# Altium schematic sheet Motor-20.SchDoc
size B; SheetNumber: 1; SheetTotal: 1
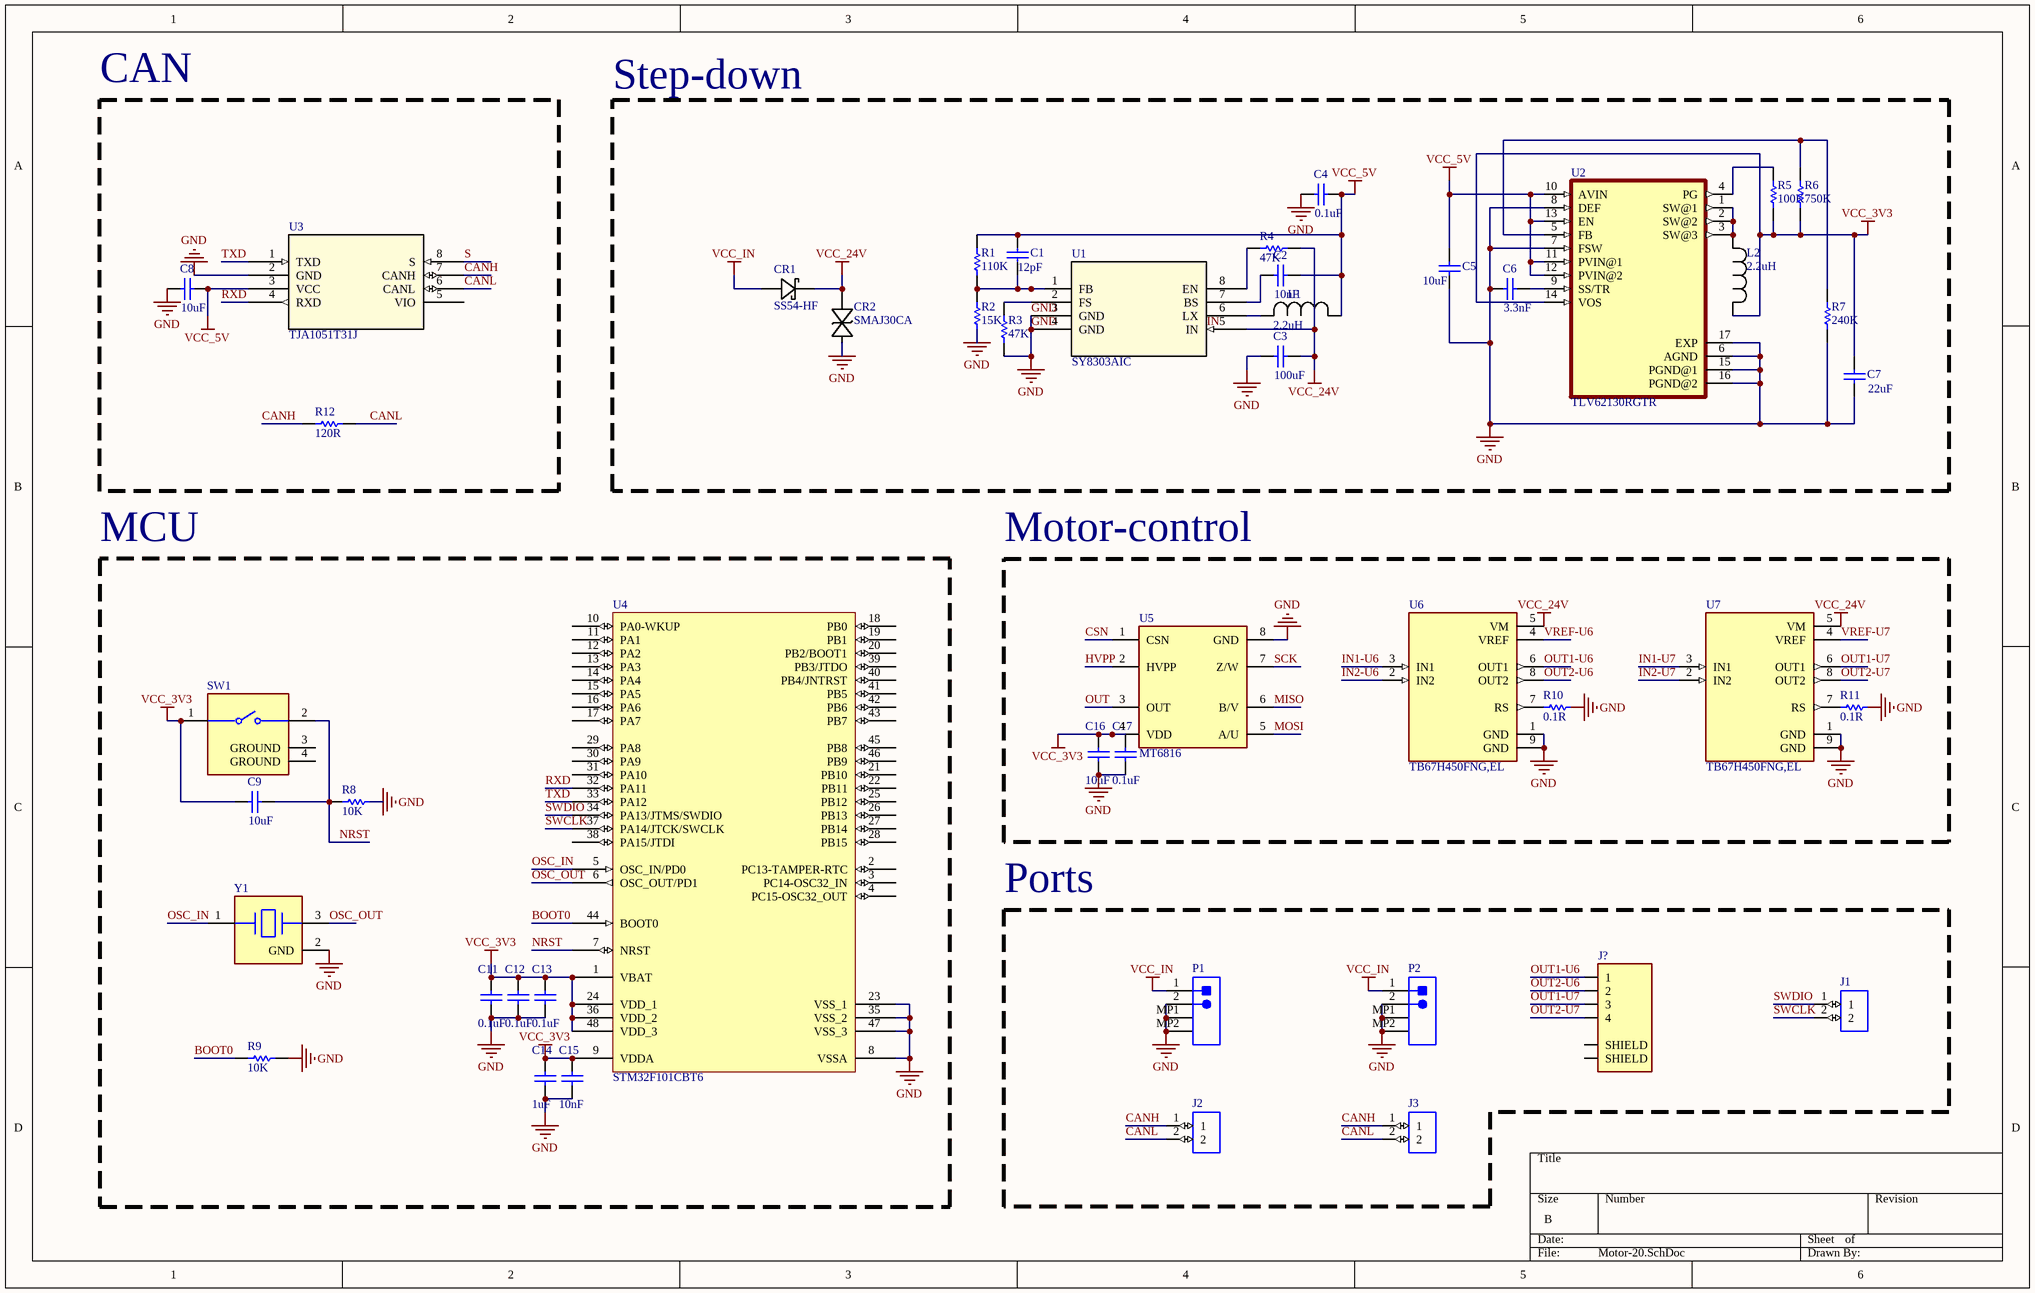
[diagram p0: Motor-20.SchDoc]

## Parts
C1  12pF  [CAPC1608X90X35ML10T15]
C2  10nF  [CAPC1608X90X35ML10T15]
C3  100uF  [CAPC1608X90X35ML10T15]
C4  0.1uF  [CAPC1608X90X35ML10T15]
C5  10uF  [CAPC1608X90X35ML10T15]
C6  3.3nF  [CAPC1608X90X35ML10T15]
C7  22uF  [CAPC1608X90X35ML10T15]
C8  10uF  [CAPC1608X90X35ML10T15]
C9  10uF  [CAPC1608X90X35ML10T15]
C11  0.1uF  [CAPC1608X90X35ML10T15]
C12  0.1uF  [CAPC1608X90X35ML10T15]
C13  0.1uF  [CAPC1608X90X35ML10T15]
C14  1uF  [CAPC1608X90X35ML10T15]
C15  10nF  [CAPC1608X90X35ML10T15]
C16  10uF  [CAPC1608X90X35ML10T15]
C17  0.1uF  [CAPC1608X90X35ML10T15]
CR1  SS54-HF  [SDO_DO-214AC_CIP]
CR2  SMAJ30CA  [SMASeries_LTF]
J1  (no value)  [SM02B-SRSS-TB(LF)(SN)]
J2  (no value)  [SM02B-SRSS-TB(LF)(SN)]
J3  (no value)  [SM02B-SRSS-TB(LF)(SN)]
J?  (no value)  [JST_SM04B-SRSS-TB(LF)(SN)]
L1  2.2uH  [IND_EPCOS_B82498F_EPC]
L2  2.2uH  [IND_EPCOS_B82498F_EPC]
P1  (no value)  [JST- S2B-PH-SM4-TB(LF)(SN)-2_V]
P2  (no value)  [JST- S2B-PH-SM4-TB(LF)(SN)-2_V]
R1  110K  [RESC1608X55X30ML20T20]
R2  15K  [RESC1608X55X30ML20T20]
R3  47K  [RESC1608X55X30ML20T20]
R4  47K  [RESC1608X55X30ML20T20]
R5  100K  [RESC1608X55X30ML20T20]
R6  750K  [RESC1608X55X30ML20T20]
R7  240K  [RESC1608X55X30ML20T20]
R8  10K  [RESC1608X55X30ML20T20]
R9  10K  [RESC1608X55X30ML20T20]
R10  0.1R  [RESC1608X55X30ML20T20]
R11  0.1R  [RESC1608X55X30ML20T20]
R12  120R  [RESC1608X55X30ML20T20]
SW1  (no value)  [FP-PTS636_SKG25_SMTR_LFS-MFG]
U1  SY8303AIC  [TSOT_303AIC_SGY]
U2  TLV62130RGTR  [QFN50P300X300X100-17N]
U3  TJA1051T31J  [SO8_SOT96-1_NXP]
U4  STM32F101CBT6  [LQFP48_N]
U5  MT6816  [SOIC127P600X175-8N-8-V]
U6  TB67H450FNG,EL  [SOIC127P599X175-9N]
U7  TB67H450FNG,EL  [SOIC127P599X175-9N]
Y1  (no value)  [FP-CSTCE_V-MFG]

## Blocks framed on the sheet
CAN: C8 R12 U3
Step-down: C1-C7 CR1 CR2 L1 L2 R1-R7 U1 U2
MCU: C9 C11-C15 R8 R9 SW1 U4 Y1
Motor-control: C16 C17 R10 R11 U5-U7
Ports: J1-J3 J? P1 P2

## Nets
GND: C3.1 C4.1 C5.1 C6.1 C7.1 C8.1 C11.1 C12.1 C13.1 C14.1 C15.1 C16.1 C17.1 CR2.2 P1.2 P1.MP1 P1.MP2 P2.2 P2.MP1 P2.MP2 R2.1 R3.1 R7.1 R8.2 R9.2 U1.3(GND) U1.4(GND) U2.6(AGND) U2.7(FSW) U2.8(DEF) U2.15(PGND@1) U2.16(PGND@2) U2.17(EXP) U3.2(GND) U4.8(VSSA) U4.23(VSS_1) U4.35(VSS_2) U4.47(VSS_3) U5.8(GND) U6.1(GND) U6.9(GND) U7.1(GND) U7.9(GND) Y1.2(GND)
VCC_3V3: C7.2 C9.1 C11.2 C12.2 C13.2 C14.2 C15.2 C16.2 C17.2 L2.1 R5.1 R6.1 SW1.1 U2.14(VOS) U4.1(VBAT) U4.9(VDDA) U4.24(VDD_1) U4.36(VDD_2) U4.48(VDD_3) U5.4(VDD)
VCC_5V: C1.2 C2.2 C4.2 C5.2 C8.2 L1.1 R1.2 U2.10(AVIN) U2.11(PVIN@1) U2.12(PVIN@2) U2.13(EN) U3.3(VCC)
VCC_24V: C3.2 CR1.1(CATHODE) CR2.1 R4.2 U1.5(IN) U6.5(VM) U7.5(VM)
VCC_IN: CR1.2(ANODE) P1.1 P2.1
BOOT0: R9.1 U4.44(BOOT0)
CANH: J2.1 J3.1 R12.1 U3.7(CANH)
CANL: J2.2 J3.2 R12.2 U3.6(CANL)
CSN: U5.1(CSN)
HVPP: U5.2(HVPP)
IN1-U6: U6.3(IN1)
IN1-U7: U7.3(IN1)
IN2-U6: U6.2(IN2)
IN2-U7: U7.2(IN2)
MISO: U5.6(B/V)
MOSI: U5.5(A/U)
NRST: C9.2 R8.1 SW1.2 U4.7(NRST)
OSC_IN: U4.5(OSC_IN/PD0) Y1.1(Input)
OSC_OUT: U4.6(OSC_OUT/PD1) Y1.3(Output)
OUT: U5.3(OUT)
OUT1-U6: J?.1 U6.6(OUT1)
OUT1-U7: J?.3 U7.6(OUT1)
OUT2-U6: J?.2 U6.8(OUT2)
OUT2-U7: J?.4 U7.8(OUT2)
RXD: U3.4(RXD) U4.32(PA11)
S: U3.8(S)
SCK: U5.7(Z/W)
SWCLK: J1.2 U4.37(PA14/JTCK/SWCLK)
SWDIO: J1.1 U4.34(PA13/JTMS/SWDIO)
TXD: U3.1(TXD) U4.33(PA12)
VREF-U6: U6.4(VREF)
VREF-U7: U7.4(VREF)
NetC1_1: C1.1 R1.1 R2.2 U1.1(FB)
NetC2_1: C2.1 U1.7(BS)
NetC6_2: C6.2 U2.9(SS/TR)
NetL1_2: L1.2 U1.6(LX)
NetL2_2: L2.2 U2.1(SW@1) U2.2(SW@2) U2.3(SW@3)
NetR3_2: R3.2 U1.2(FS)
NetR4_1: R4.1 U1.8(EN)
NetR5_2: R5.2 U2.4(PG)
NetR6_2: R6.2 R7.2 U2.5(FB)

Not connected (* = marked no-connect by the designer): J? S1(SHIELD) S2(SHIELD); R10 1 2; R11 1 2; SW1 3(GROUND) 4(GROUND); U3 5(VIO); U4 2(PC13-TAMPER-RTC) 3(PC14-OSC32_IN) 4(PC15-OSC32_OUT) 10(PA0-WKUP) 11(PA1) 12(PA2) 13(PA3) 14(PA4) 15(PA5) 16(PA6) 17(PA7) 18(PB0) 19(PB1) 20(PB2/BOOT1) 21(PB10) 22(PB11) 25(PB12) 26(PB13) 27(PB14) 28(PB15) 29(PA8) 30(PA9) 31(PA10) 38(PA15/JTDI) 39(PB3/JTDO) 40(PB4/JNTRST) 41(PB5) 42(PB6) 43(PB7) 45(PB8) 46(PB9); U6 7(RS); U7 7(RS)

## Notes on the sheet
- Labels drawn without touching a wire or pin: GND, IN

## Library data of the parts
C1-C9 C11-C17 = CMP-2006-02924-1: Part Number: GRM188R71H472KA01D; Manufacturer: Murata
CR1 = SS54-HF: No Description Available; Mfr_Name: Comchip; Type: Diodes - Rectifiers, Single
CR2 = SMAJ30CA: No Description Available; Mfr_Name: Littelfuse Inc
J1-J3 = SM02B-SRSS-TB(LF)(SN): Connector Header Surface Mount, Right Angle 2 position 0.039 _1.00mm_; MP: SM02B-SRSS-TB_LF__SN_; MF: JST Sales; SnapEDA_Link: https://www.snapeda.com/parts/SM02B-SRSS-TB%28LF%29%28SN%29/JST%20Sales%20America%20Inc./view-part/447499/?ref=snap; Price: None; Value: *; Availability: Unavailable; Package: None
J? = SM04B-SRSS-TB(LF)(SN): SH Series 1.0 mm Pitch 2 Position Single Row Side Entry Shrouded Header; Price: None; Value: *; MP: SM04B-SRSS-TB(LF)(SN); Package: None; Availability: Unavailable
L1 L2 = B82498F3100+000: No Description Available; Mfr_Name: TDK
P1 P2 = CMP-1755-00001-1: Male Header, Pitch 2 mm, 1 x 2 Position, Height 5.5 mm, -25 to 85 degC, RoHS, Tape and Reel; Current Rating: 3 A; ComponentLink1URL: http://www.jst.com/home2.html; Radiation Hardening: No; RoHSCompliant: True; Mount: Through Hole; Contact Material: Bronze; Package Quantity: 100; Width: 2.34 mm; DatasheetVersion: Dec-12; Height: 8.13 mm; Max Operating Temperature: 105degC; ComponentLink2Description: Datasheet; Lead Pitch: 0.1 inch; Contact Finish: Lead; Packaging: Bulk; Colour: Black; Contact Plating: Tin; Min Operating Temperature: -65degC; ComponentLink1Description: Manufacturer URL; PackageReference: S2B-PH-SM4-TB(LF)(SN)-2; PackageDescription: Male Header, Pitch 2 mm, 1 x 2 Position, Height 5.5 mm; ComponentLink2URL: http://www.jst-mfg.com/product/pdf/eng/ePH.pdf; Pins: 40; Length: 101.19 mm
R1-R12 = CMP-2000-00054-1: Part Number: ERA3AEB392V; Manufacturer: Panasonic
SW1 = CMP-10040-000025-1: TACT 6.0 X 3.5, 2.5 MM H, 250GF,
U1 = SY8303AIC: No Description Available; Mfr_Name: Silergy; RefDes: RefDes; Type: Type
U2 = TLV62130RGTR: 3-17V 3A Step-Down Converter in 3x3 QFN Package 16-VQFN -40 to 85; MF: Texas Instruments; Mouser-Purchase-URL: https://snapeda.com/shop?store=Mouser&id=423292; MP: TLV62130RGTR; Value: *; DigiKey-Purchase-URL: https://snapeda.com/shop?store=DigiKey&id=423292; Package: VQFN-16 Texas Instruments; Texas_Instruments-Purchase-URL: https://snapeda.com/shop?store=Texas+Instruments&id=423292; Price: None; Availability: Unavailable; SnapEDA_Link: https://www.snapeda.com/parts/TLV62130RGTR/Texas%20Instruments/view-part/423292/?ref=snap
U3 = TJA1051T31J: No Description Available; Mfr_Name: NXP; RefDes: RefDes; Type: Type
U4 = STM32F101CBT6: STM32 ARM-based 32-bit MCU with 128 Kbytes Flash, 48-pin LQFP, Industrial Temperature; Published: 30-May-2008; DatasheetVersion: rev6, Mar-2008; PackageVersion: Mar-2008; PackageReference: LQFP48; Publisher: Altium Limited; PackageDescription: 48-Pin Low-Profile Quad Flat Pack, 7 x 7 mm Body, 0.5 mm Pitch (LQFP48); ComponentLink1Description: Manufacturer Link; ComponentLink1URL: www.st.com/stm32; ComponentLink2Description: Datasheet; ComponentLink2URL: http://www.st.com/stonline/products/literature/ds/13586.pdf
U5 = TLE5012B_E1000: TLE5012B/TLI5012B Angular and Linear Position Sensor Evaluation Board Automotive; MF: Infineon Technologies; MP: TLE5012B E1000; Package: SOIC-8 Infineon Technologies; Price: None; Value: *; SnapEDA_Link: https://www.snapeda.com/parts/TLE5012B%20E1000/Infineon+Technologies/view-part/?ref=snap; Availability: In Stock; Check_prices: https://www.snapeda.com/parts/TLE5012B%20E1000/Infineon+Technologies/view-part/?ref=eda
U6 U7 = TB67H450FNG,EL: - Motor Driver - - 8-HSOP; MF: Toshiba Semiconductor and Storage; Package: SOIC-8 Toshiba Semiconductor and Storage; Price: None; Check_prices: https://www.snapeda.com/parts/TB67H450FNG,EL/Toshiba+Semiconductor+and+Storage/view-part/?ref=eda; Value: *; SnapEDA_Link: https://www.snapeda.com/parts/TB67H450FNG,EL/Toshiba+Semiconductor+and+Storage/view-part/?ref=snap; MP: TB67H450FNG,EL; Availability: In Stock; Purchase-URL: https://pricing.snapeda.com/search?q=TB67H450FNG,EL&ref=eda
Y1 = CMP-06057-000013-1: CERAMIC RES 20.0000MHZ 15PF SMD; Self Resonant Frequency: 20MHz; Frequency Stability: 0.3%; Tolerance: 0.5%; Impedance: 40R; Height: 0.039inch; Package Quantity: 3000; Capacitance: 15pF; Mount: Surface Mount; Length: 0.126inch; Load Capacitance: 15pF; Resistor Type: Ceramic; Width: 0.051inch; Termination: SMD/SMT; Frequency Tolerance: 0.5%; Case/Package: SMD/SMT; Contact Plating: Gold; Lead Free: Lead Free; Number of Pins: 3; Packaging: Tape and Reel; Min Operating Temperature: -20°C; REACH SVHC: No SVHC; Max Operating Temperature: 80°C; Frequency: 20MHz